# EAGLE design Minimal_carrier_board_for_CM4_rev_C (EAGLE 9.6.2)
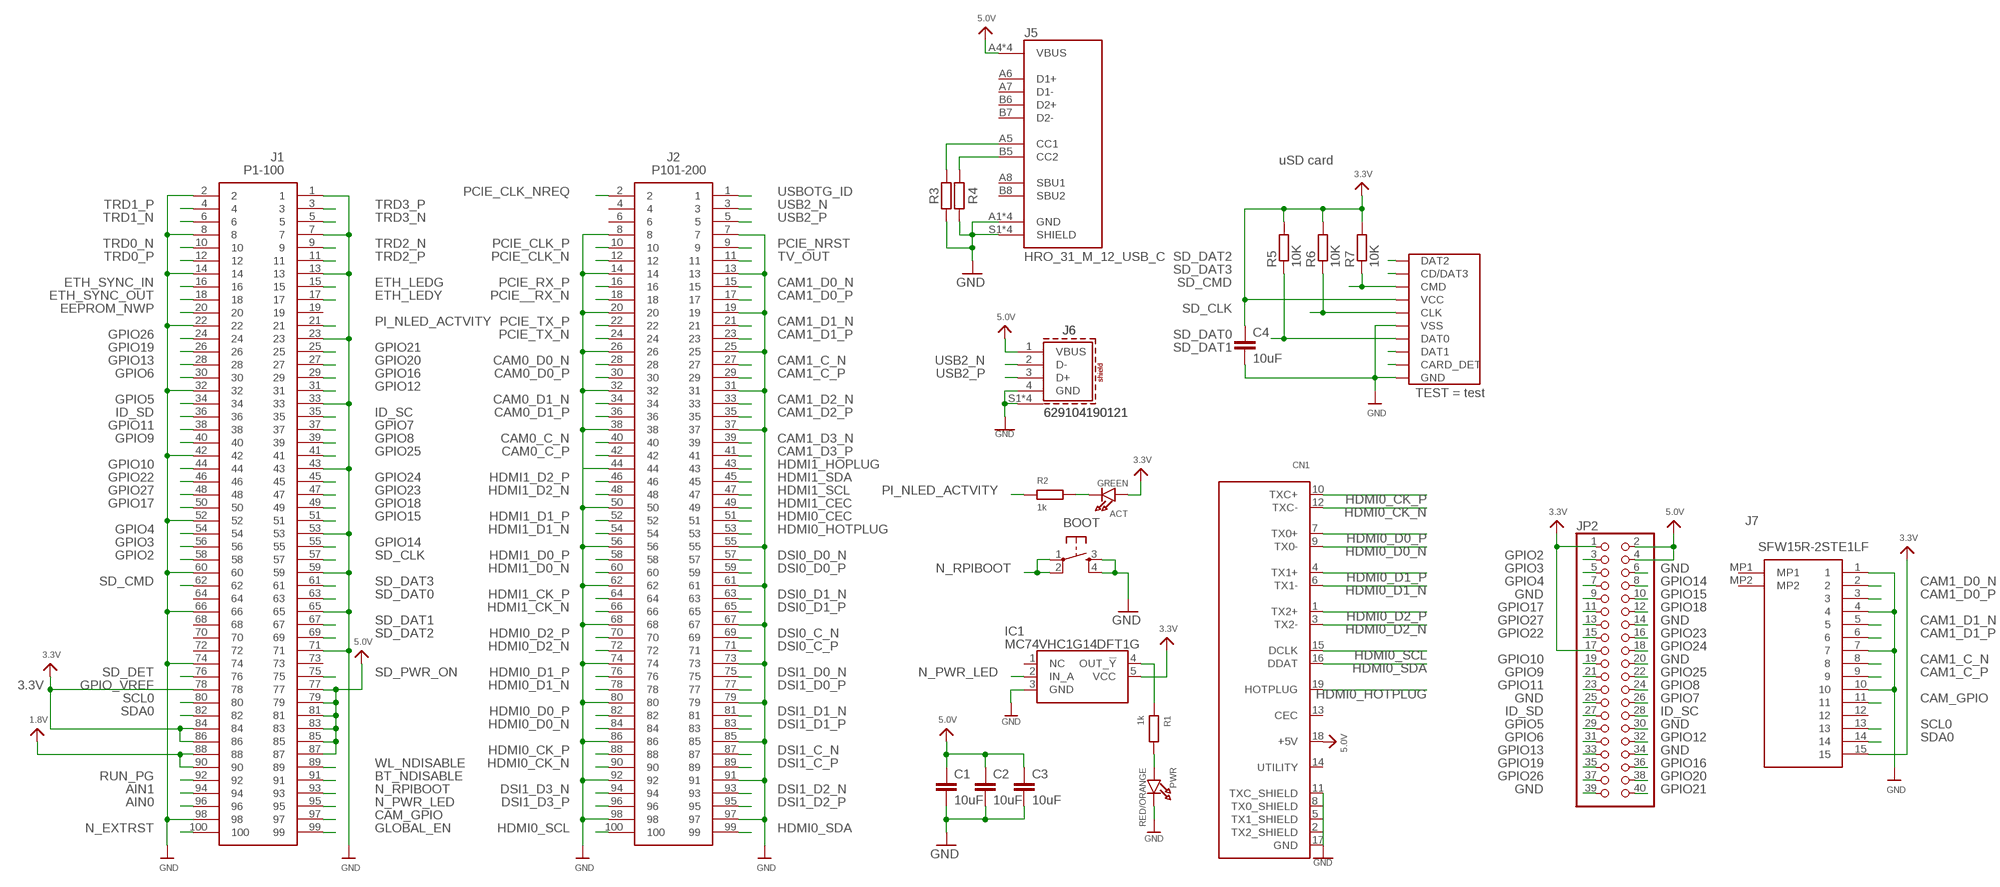
[diagram p0: schematic, sheet 1]

## Parts
ACT  GREEN  LED0805_NOOUTLINE  [CHIPLED_0805_NOOUTLINE]
BOOT  TACTILE_SWITCHE_5X5_MICRO_  [TACTILE_SWITCH_5X5_MICRO]
C1  10uF  C-EUC0805  [C0805]
C2  10uF  C-EUC0805  [C0805]
C3  10uF  C-EUC0805  [C0805]
C4  10uF  C-EUC0805  [C0805]
CN1  HDMI_MOLEX_47151-0001  [HDMI_MOLEX_47151-0001]
IC1  MC74VHC1G14DFT1G  [SOT65P210X110-5N]
J1  P1-100  DF40C-100DS-0.4V_51_  [DF40C100DS04V51]
J2  P101-200  DF40C-100DS-0.4V_51_  [DF40C100DS04V51]
J5  HRO_31_M_12_USB_C  [HRO_31_M_12_USB_C]
J6  629104190121  [629104190121]
J7  SFW15R-2STE1LF  [SFW15R2STE1LF]
JP2  PINHD-2X20  [2X20]
PWR  RED/ORANGE  LED0805_NOOUTLINE  [CHIPLED_0805_NOOUTLINE]
R1  1k  R-EU_R0805  [R0805]
R2  1k  R-EU_R0805  [R0805]
R3  5.1k  R-EU_R0805  [R0805]
R4  5.1k  R-EU_R0805  [R0805]
R5  10K  R-EU_R0805  [R0805]
R6  10K  R-EU_R0805  [R0805]
R7  10K  R-EU_R0805  [R0805]
SD_CARD  MICRO_SD_CARD_  [TFP09-2--12B]

## Nets
1.8V: J1.88 J1.90
3.3V: ACT.A C4.1 IC1.5(VCC) J1.78 J1.84 J1.86 J7.15 JP2.1 JP2.17 R5.2 R6.2 R7.2 SD_CARD.VCC
5.0V: C1.1 C2.1 C3.1 CN1.18(+5V) J1.77 J1.79 J1.81 J1.83 J1.85 J1.87 J5.A4(VBUS) J5.A9(VBUS) J5.B4(VBUS) J5.B9(VBUS) J6.1(VBUS) JP2.2 JP2.4
AIN0: J1.96
AIN1: J1.94
BT_NDISABLE: J1.91
CAM0_C_N: J2.40
CAM0_C_P: J2.42
CAM0_D0_N: J2.28
CAM0_D0_P: J2.30
CAM0_D1_N: J2.34
CAM0_D1_P: J2.36
CAM1_C_N [diff_pairs]: J2.27 J7.8
CAM1_C_P [diff_pairs]: J2.29 J7.9
CAM1_D0_N [diff_pairs]: J2.15 J7.2
CAM1_D0_P [diff_pairs]: J2.17 J7.3
CAM1_D1_N [diff_pairs]: J2.21 J7.5
CAM1_D1_P [diff_pairs]: J2.23 J7.6
CAM1_D2_N [diff_pairs]: J2.33
CAM1_D2_P [diff_pairs]: J2.35
CAM1_D3_N [diff_pairs]: J2.39
CAM1_D3_P [diff_pairs]: J2.41
CAM_GPIO: J1.97 J7.11
DSI0_C_N: J2.69
DSI0_C_P: J2.71
DSI0_D0_N: J2.57
DSI0_D0_P: J2.59
DSI0_D1_N: J2.63
DSI0_D1_P: J2.65
DSI1_C_N [diff_pairs]: J2.87
DSI1_C_P [diff_pairs]: J2.89
DSI1_D0_N [diff_pairs]: J2.75
DSI1_D0_P [diff_pairs]: J2.77
DSI1_D1_N [diff_pairs]: J2.81
DSI1_D1_P [diff_pairs]: J2.83
DSI1_D2_N [diff_pairs]: J2.93
DSI1_D2_P [diff_pairs]: J2.95
DSI1_D3_N [diff_pairs]: J2.94
DSI1_D3_P [diff_pairs]: J2.96
EEPROM_NWP: J1.20
ETH_LEDG: J1.15
ETH_LEDY: J1.17
ETH_SYNC_IN: J1.16
ETH_SYNC_OUT: J1.18
GLOBAL_EN: J1.99
GND: BOOT.3 BOOT.4 C1.2 C2.2 C3.2 C4.2 CN1.2(TX2_SHIELD) CN1.5(TX1_SHIELD) CN1.8(TX0_SHIELD) CN1.11(TXC_SHIELD) CN1.17(GND) IC1.3(GND) J1.1 J1.2 J1.7 J1.8 J1.13 J1.14 J1.22 J1.23 J1.32 J1.33 J1.42 J1.43 J1.52 J1.53 J1.59 J1.60 J1.65 J1.66 J1.71 J1.74 J1.98 J2.7 J2.8 J2.13 J2.14 J2.19 J2.20 J2.25 J2.26 J2.31 J2.32 J2.37 J2.38 J2.44 J2.50 J2.55 J2.56 J2.61 J2.62 J2.67 J2.68 J2.73 J2.74 J2.79 J2.80 J2.85 J2.86 J2.91 J2.92 J2.97 J2.98 J5.A1(GND) J5.A12(GND) J5.B1(GND) J5.B12(GND) J5.S1(SHIELD) J5.S2(SHIELD) J5.S3(SHIELD) J5.S4(SHIELD) J6.4(GND) J6.S1(SHIELD) J6.S2(SHIELD) J6.S3(SHIELD) J6.S4(SHIELD) J7.1 J7.4 J7.7 J7.10 JP2.6 JP2.9 JP2.14 JP2.20 JP2.25 JP2.30 JP2.34 JP2.39 PWR.C R3.1 R4.2 SD_CARD.GND SD_CARD.GND@1(GND) SD_CARD.GND@2(GND) SD_CARD.GND@3(VSS) SD_CARD.VSS(GND)
GPIO2: J1.58 JP2.3
GPIO3: J1.56 JP2.5
GPIO4: J1.54 JP2.7
GPIO5: J1.34 JP2.29
GPIO6: J1.30 JP2.31
GPIO7: J1.37 JP2.26
GPIO8: J1.39 JP2.24
GPIO9: J1.40 JP2.21
GPIO10: J1.44 JP2.19
GPIO11: J1.38 JP2.23
GPIO12: J1.31 JP2.32
GPIO13: J1.28 JP2.33
GPIO14: J1.55 JP2.8
GPIO15: J1.51 JP2.10
GPIO16: J1.29 JP2.36
GPIO17: J1.50 JP2.11
GPIO18: J1.49 JP2.12
GPIO19: J1.26 JP2.35
GPIO20: J1.27 JP2.38
GPIO21: J1.25 JP2.40
GPIO22: J1.46 JP2.15
GPIO23: J1.47 JP2.16
GPIO24: J1.45 JP2.18
GPIO25: J1.41 JP2.22
GPIO26: J1.24 JP2.37
GPIO27: J1.48 JP2.13
HDMI0_CEC: J2.51
HDMI0_CK_N [diff_pairs]: CN1.12(TXC-) J2.90
HDMI0_CK_P [diff_pairs]: CN1.10(TXC+) J2.88
HDMI0_D0_N [diff_pairs]: CN1.9(TX0-) J2.84
HDMI0_D0_P [diff_pairs]: CN1.7(TX0+) J2.82
HDMI0_D1_N [diff_pairs]: CN1.6(TX1-) J2.78
HDMI0_D1_P [diff_pairs]: CN1.4(TX1+) J2.76
HDMI0_D2_N [diff_pairs]: CN1.3(TX2-) J2.72
HDMI0_D2_P [diff_pairs]: CN1.1(TX2+) J2.70
HDMI0_HOTPLUG: CN1.19(HOTPLUG) J2.53
HDMI0_SCL: CN1.15(DCLK) J2.100
HDMI0_SDA: CN1.16(DDAT) J2.99
HDMI1_CEC: J2.49
HDMI1_CK_N: J2.66
HDMI1_CK_P: J2.64
HDMI1_D0_N: J2.60
HDMI1_D0_P: J2.58
HDMI1_D1_N: J2.54
HDMI1_D1_P: J2.52
HDMI1_D2_N: J2.48
HDMI1_D2_P: J2.46
HDMI1_HOPLUG: J2.43
HDMI1_SCL: J2.47
HDMI1_SDA: J2.45
ID_SC: J1.35 JP2.28
ID_SD: J1.36 JP2.27
N$1: ACT.C R2.2
N$3: J5.B5(CC2) R4.1
N$4: IC1.4(OUT_!Y) R1.1
N$5: J5.A5(CC1) R3.2
N$6: PWR.A R1.2
N$9: SD_CARD.CD(CARD_DET)
N_EXTRST: J1.100
N_PWR_LED: IC1.2(IN_A) J1.95
N_RPIBOOT: BOOT.1 BOOT.2 J1.93
PCIE__RX_N: J2.18
PCIE_CLK_N: J2.12
PCIE_CLK_NREQ: J2.2
PCIE_CLK_P: J2.10
PCIE_NRST: J2.9
PCIE_RX_P: J2.16
PCIE_TX_N: J2.24
PCIE_TX_P: J2.22
PI_NLED_ACTVITY: J1.21 R2.1
RUN_PG: J1.92
SCL0: J1.80 J7.13
SD_CLK: J1.57 R6.1 SD_CARD.CLK
SD_CMD: J1.62 R7.1 SD_CARD.CMD
SD_DAT0: J1.63 R5.1 SD_CARD.DAT0
SD_DAT1: J1.67 SD_CARD.DAT1
SD_DAT2: J1.69 SD_CARD.DAT2
SD_DAT3: J1.61 SD_CARD.CD/DAT3
SD_DET: J1.76
SD_PWR_ON: J1.75
SDA0: J1.82 J7.14
TRD0_N: J1.10
TRD0_P: J1.12
TRD1_N: J1.6
TRD1_P: J1.4
TRD2_N: J1.9
TRD2_P: J1.11
TRD3_N: J1.5
TRD3_P: J1.3
TV_OUT: J2.11
USB2_N: J2.3 J6.2(D-)
USB2_P [diff_pairs]: J2.5 J6.3(D+)
USBOTG_ID: J2.1
WL_NDISABLE: J1.89
Unconnected: CN1.13(CEC) CN1.14(UTILITY) IC1.1(NC) J1.19 J1.64 J1.68 J1.70 J1.72 J1.73 J2.4 J2.6 J5.A6(D1+) J5.A7(D1-) J5.A8(SBU1) J5.B6(D2+) J5.B7(D2-) J5.B8(SBU2) J7.12 J7.MP1 J7.MP2

## Notes on the sheet
- uSD card
- GPIO_VREF

## Power pins joined to a net without a drawn wire
GND: CN1.P$1(GND) CN1.P$2(GND) CN1.P$3(GND) CN1.P$4(GND)

## Library data of the parts
ACT PWR = dronecz:LED: LED 0603 - 0603 Surface Mount Package 2mA: Green LED - Low Power (3.9mcd, 2ma, 1.7Vf) - Digikey: 475-2709-2-ND Orange LED - Low Power (9.8mcd, 2ma, 1.8Vf) - Digikey: 475-1194-2-ND Red LED - Low Power (5mcd, 2ma, 1.8Vf) - Digikey: 475-1195-2-ND Yellow LED - Low Power (7mcd, 2ma, 1.8Vf) - Digikey: 475-1196-2-ND 5mA: Blue LED - Low Power (17mcd, 5ma, 2.9Vf) - Digikey: LNJ937W8CRACT-ND 0805 - 0805 Surface Mount Package 2mA: Red LED (8.8mcd, 2mA, 1.8Vf, Clear) - Low Power [Digikey: 475-2510-1-ND] Green LED (5mcd, 2mA, 1.8Vf, Clear) - Low Power [Digikey: 475-2730-1-ND] Yellow LED (11.3mcd, 2mA, 1.8Vf, Clear) - Low Power [Digikey: 475-2555-1-ND] 20mA: Red LED (104mcd, 20mA, Diffused) - LS R976 [Digikey: 475-1278-6-ND] Red LED (12mcd, 20mA, 2.0Vf, Clear) - APT2012EC [Digikey: 754-1128-1-ND] Green LED (15mcd, 20mA, 2.2Vf, Clear) - APT2012GC [Digikey: 754-1131-1-ND] Orange LED (160mcd, 20mA, 2.1Vf, Clear) - APT2012SECK [Digikey: 754-1130-1-ND] 1206 - 1206 Surface Mount Package Green LED (26mcd, 20mA, Diffused) - LG N971 [Digikey: 475-1407-6-ND] Red LED (15mcd, 20mA, Diffused) - LH N974 [Digikey: 475-1416-6-ND]
BOOT = dronecz:TACTILE_SWITCHE_5X5_MICRO
C1-C4 = rcl:C-EU: CAPACITOR, European symbol; SPICEPREFIX: C
CN1 = dronecz:HDMI_MOLEX_47151-0001; LINK: https://cz.mouser.com/ProductDetail/Molex/47151-1081?qs=rg3U%2F5nEhHf8zd%2FI8aNW2A%3D%3D
IC1 = dronecz:MC74VHC1G14DFT1G: Source: Datasheet <http://www.onsemi.com/pub/Collateral/MC74VHC1G14-D.PDF>; HEIGHT: 1.1mm; MANUFACTURER_NAME: ON Semiconductor; MANUFACTURER_PART_NUMBER: MC74VHC1G14DFT1G; MOUSER_PART_NUMBER: 863-MC74VHC1G14DFT1G; MOUSER_PRICE-STOCK: https://www.mouser.co.uk/ProductDetail/ON-Semiconductor/MC74VHC1G14DFT1G?qs=YOLdObVcOZkl2BbCxsVnXA%3D%3D
J1 J2 = dronecz:DF40C-100DS-0.4V_51_: HIROSE(HRS) - DF40C-100DS-0.4V(51) - CONNECTOR, STACKING, RCPT, 100POS, 2ROW Source: Datasheet <https://www.hirose.com/product/en/download_file/key_name/DF40C-100DS-0.4V(51)/category/Drawing (2D)/doc_file_id/46856/?file_category_id=6&item_id=06844033451&is_series=>; DESCRIPTION: HIROSE(HRS) - DF40C-100DS-0.4V(51) - CONNECTOR, STACKING, RCPT, 100POS, 2ROW; HEIGHT: 1.65mm; MANUFACTURER_NAME: Hirose; MANUFACTURER_PART_NUMBER: DF40C-100DS-0.4V(51); MOUSER_PART_NUMBER: 798-DF40C100DS0.4V51; MOUSER_PRICE-STOCK: https://www.mouser.co.uk/ProductDetail/Hirose-Connector/DF40C-100DS-04V51?qs=eDUdFcBPps2MEwbnuPvZzQ%3D%3D
J5 = dronecz:HRO_31_M_12_USB_C: USB Shielded I/O Receptacle; Type C; Right Angle; Surface Mount; Gold over Nickel
J6 = dronecz:629104190121: WR-COM USB 2.0 Type A Horizontal SMT Short Type Kind Properties Durability:1500 Mating cycles Quality Class:1500 Mating cycles Connector Type:USB 2.0 Gender:Receptacle Type:Horizontal - Short Type General Information Operating Temperature:-40 up to +85 °C Compliance:RoHS Electrical Properties IR 1:1.5A Working Voltage:30V (AC) Withstanding Voltage:500 V (AC) Contact Resistance:30 mΩ Material Properties Insulator Material:LCP Insulator Flammability Rating:UL94 V-0 Color:Black Cover Material:Brass Cover Plating:Nickel Contact Material:Brass Contact Plating:Gold over Nickel Contact Type:Stamped Shielding Material:Brass Shielding Plating:Nickel <https://www.we-online.com/catalog/media/o85075v209%20Family_WR-COM_629104190121.jpg> Details see: https://www.we-online.com/catalog/en/COM_2_0_SMT_TYPE_A_HORIZONTAL_SHORT_TYPE/ Updated by Ella Wu 2020-08-05 2020 (C) Würth Elektronik; APPLICATION: USB 2.0; DATASHEET-URL: https://www.we-online.com/catalog/datasheet/629104190121.pdf; GERDER: Receptacle; INTERFACE-TYPE: Type A; IR1: 1.5A; MOUNT: SMT; PACKAGING: Tape and Reel & Mylar; PART-NUMBER: 629104190121; PINS: 4; TYPE: Horizontal - Short Type; WORKING-VOLTAGE: 30V(AC)
J7 = dronecz:SFW15R-2STE1LF: FFC & FPC Connectors 15P SIDE SMT ZIF UPPER CONTACT Source: Datasheet <https://cdn.amphenol-icc.com/media/wysiwyg/files/drawing/sfw12lf.pdf>; DESCRIPTION: FFC & FPC Connectors 15P SIDE SMT ZIF UPPER CONTACT; HEIGHT: 2.7mm; MANUFACTURER_NAME: Amphenol; MANUFACTURER_PART_NUMBER: SFW15R-2STE1LF; MOUSER_PART_NUMBER: 649-SFW15R-2STE1LF; MOUSER_PRICE-STOCK: https://www.mouser.co.uk/ProductDetail/Amphenol-FCI/SFW15R-2STE1LF/?qs=XRaITl65jnu3B148xsdn9A%3D%3D
JP2 = pinhead:PINHD-2X20: PIN HEADER
R1-R7 = rcl:R-EU_: RESISTOR, European symbol; SPICEPREFIX: R
SD_CARD = dronecz:MICRO_SD_CARD; TEST: test

## Net classes
1 diff_pairs: width 0.152 mm

## Board
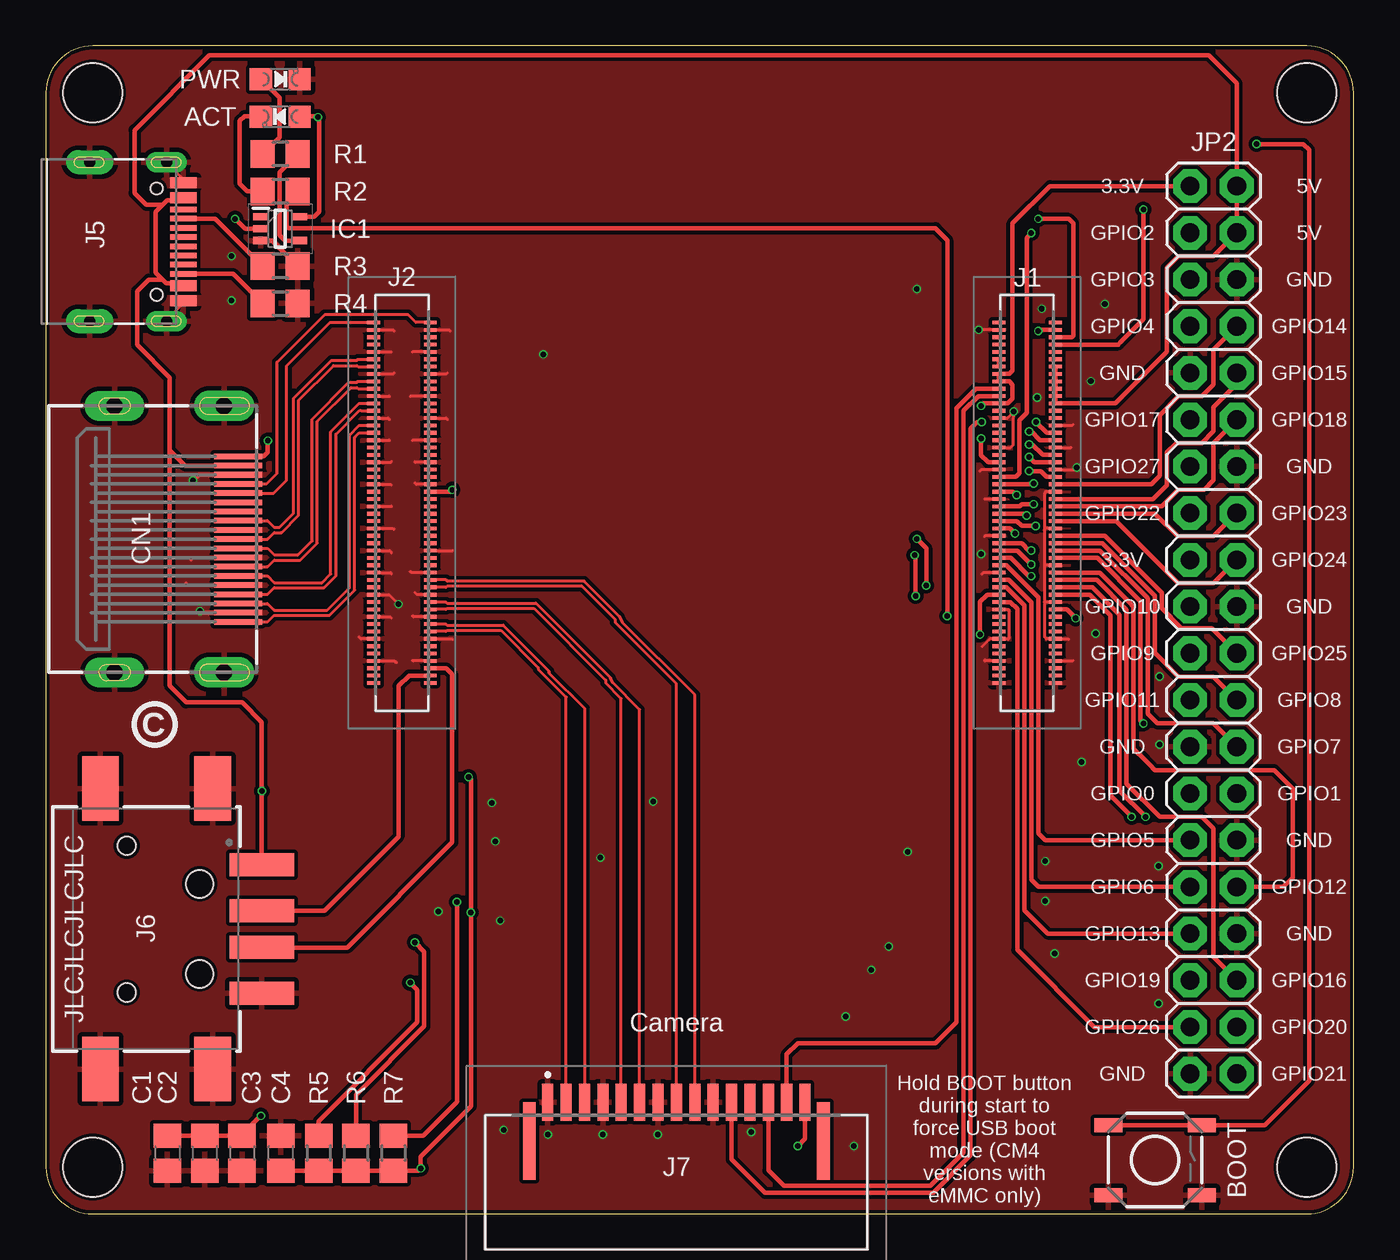
[diagram p1: board, top side]
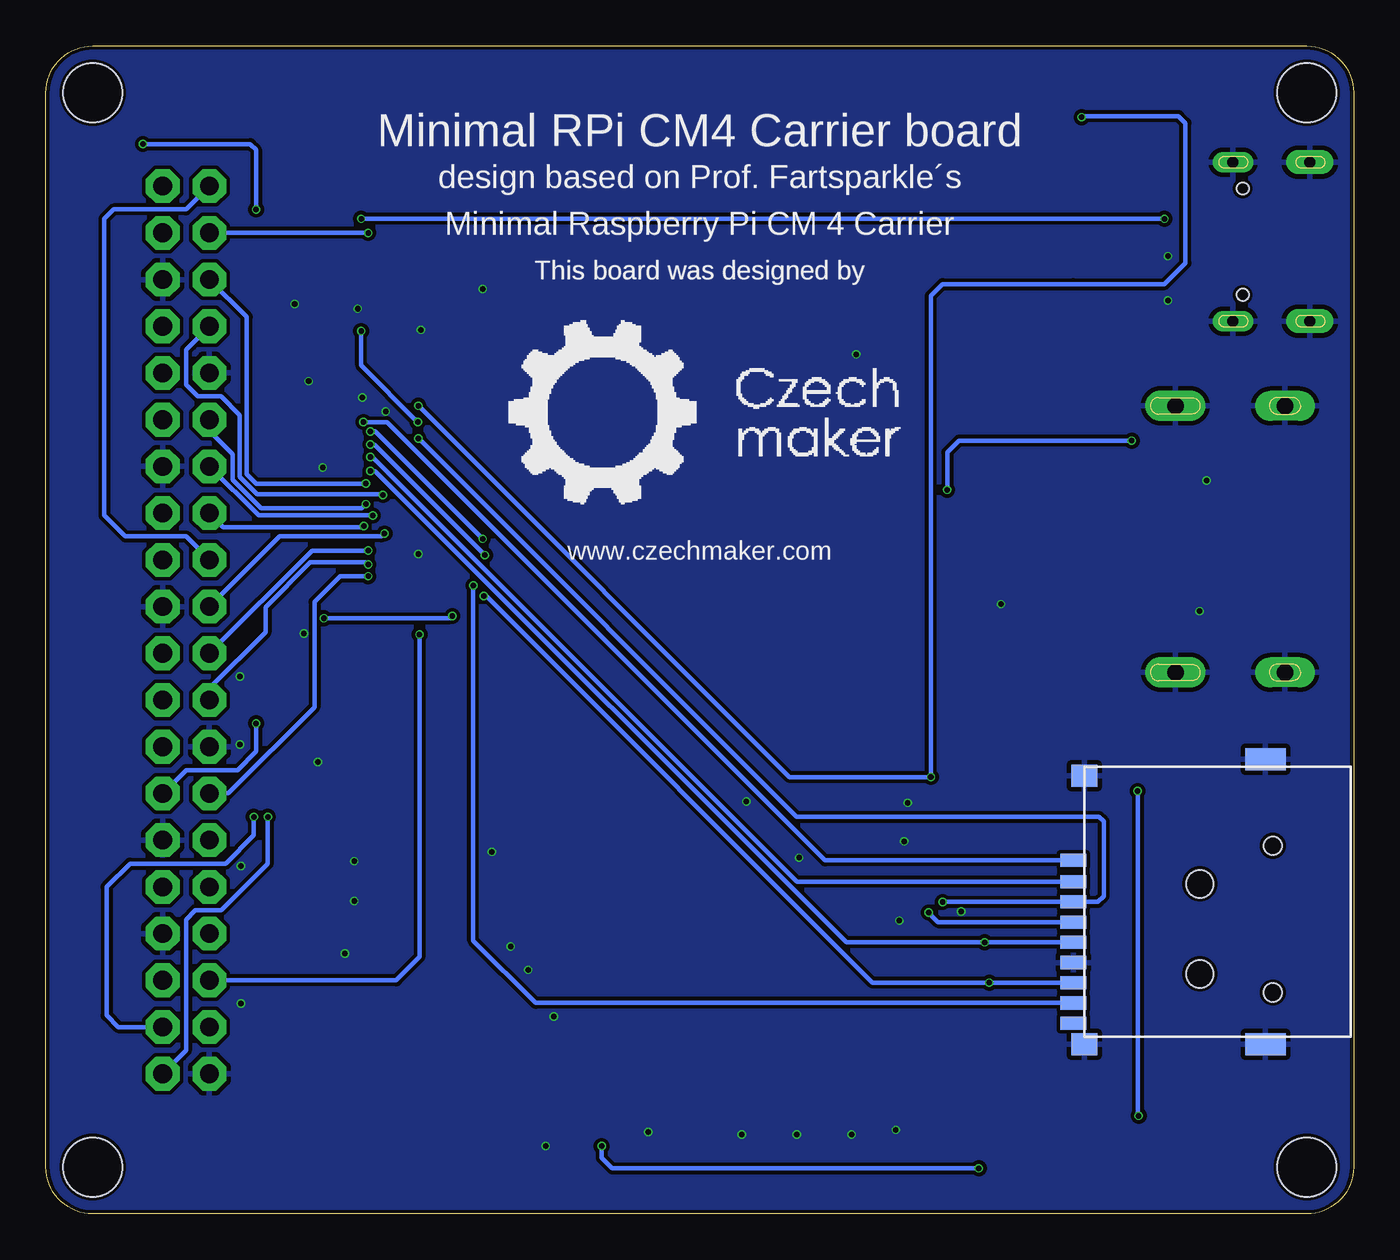
[diagram p2: board, bottom side, seen from below]

Size 71.12 x 63.5 mm. Coordinates in mm from the lower left corner, seen from the top.
Outline: 2.54,0 68.58,0 arc90 71.12,2.54 71.12,60.96 arc90 68.58,63.5 2.54,63.5 arc90 0,60.96 0,2.54 arc90 2.54,0
Copper layers (1*16): Top 0.035mm / dielectric 1.6mm / Bottom 0.035mm
Design rules "jlcpcb2layer": minimum track width 5mil, minimum drill 0.3mm, track to track 5mil, track to pad 5mil, pad to pad 5mil, via to via 5mil, smd to smd 5mil, copper to edge 0.2mm, drill to drill 6mil, minimum pad ring 10mil, minimum via ring 3mil, stop-mask expansion 4mil, vias tented up to drill 0mil, thermal gap 10mil
Holes 3.2 mm at 68.58,2.54 2.54,2.54 68.58,60.96 2.54,60.96

### Footprints (pad centres in the part's own frame; a part is rotated, then mirrored left to right if it is on the bottom)
CHIPLED_0805_NOOUTLINE = smd 1.2 x 1.2: A 0,-1.05; C 0,1.05
TACTILE_SWITCH_5X5_MICRO = smd 1.524 x 0.762: 1 -2.54,1.905; 2 2.54,1.905; 3 -2.54,-1.905; 4 2.54,-1.905
C0805 = smd 1.3 x 1.5: 1 -0.95,0; 2 0.95,0
HDMI_MOLEX_47151-0001 = smd 0.3 x 2.6: 1 4.5,0; 2 4,0; 3 3.5,0; 4 3,0; 5 2.5,0; 6 2,0; 7 1.5,0; 8 1,0; 9 0.5,0; 10 0,0; 11 -0.5,0; 12 -1,0; 13 -1.5,0; 14 -2,0; 15 -2.5,0; 16 -3,0; 17 -3.5,0; 18 -4,0; 19 -4.5,0 | drill 0.9 pad 1.65 long: P$1 -7.25,-0.76; P$2 7.25,-0.76 | drill 0.9 pad 1.5 long: P$3 7.25,-6.72; P$4 -7.25,-6.72
SOT65P210X110-5N = smd 0.85 x 0.4: 1 -1.05,0.65; 2 -1.05,0; 3 -1.05,-0.65; 4 1.05,-0.65; 5 1.05,0.65
DF40C100DS04V51 = smd 0.2 x 0.7: 1 -9.8,-1.54; 2 -9.8,1.54; 3 -9.4,-1.54; 4 -9.4,1.54; 5 -9,-1.54; 6 -9,1.54; 7 -8.6,-1.54; 8 -8.6,1.54; 9 -8.2,-1.54; 10 -8.2,1.54; 11 -7.8,-1.54; 12 -7.8,1.54; 13 -7.4,-1.54; 14 -7.4,1.54; 15 -7,-1.54; 16 -7,1.54; 17 -6.6,-1.54; 18 -6.6,1.54; 19 -6.2,-1.54; 20 -6.2,1.54; 21 -5.8,-1.54; 22 -5.8,1.54; 23 -5.4,-1.54; 24 -5.4,1.54; 25 -5,-1.54; 26 -5,1.54; 27 -4.6,-1.54; 28 -4.6,1.54; 29 -4.2,-1.54; 30 -4.2,1.54; 31 -3.8,-1.54; 32 -3.8,1.54; 33 -3.4,-1.54; 34 -3.4,1.54; 35 -3,-1.54; 36 -3,1.54; 37 -2.6,-1.54; 38 -2.6,1.54; 39 -2.2,-1.54; 40 -2.2,1.54; 41 -1.8,-1.54; 42 -1.8,1.54; 43 -1.4,-1.54; 44 -1.4,1.54; 45 -1,-1.54; 46 -1,1.54; 47 -0.6,-1.54; 48 -0.6,1.54; 49 -0.2,-1.54; 50 -0.2,1.54; 51 0.2,-1.54; 52 0.2,1.54; 53 0.6,-1.54; 54 0.6,1.54; 55 1,-1.54; 56 1,1.54; 57 1.4,-1.54; 58 1.4,1.54; 59 1.8,-1.54; 60 1.8,1.54; 61 2.2,-1.54; 62 2.2,1.54; 63 2.6,-1.54; 64 2.6,1.54; 65 3,-1.54; 66 3,1.54; 67 3.4,-1.54; 68 3.4,1.54; 69 3.8,-1.54; 70 3.8,1.54; 71 4.2,-1.54; 72 4.2,1.54; 73 4.6,-1.54; 74 4.6,1.54; 75 5,-1.54; 76 5,1.54; 77 5.4,-1.54; 78 5.4,1.54; 79 5.8,-1.54; 80 5.8,1.54; 81 6.2,-1.54; 82 6.2,1.54; 83 6.6,-1.54; 84 6.6,1.54; 85 7,-1.54; 86 7,1.54; 87 7.4,-1.54; 88 7.4,1.54; 89 7.8,-1.54; 90 7.8,1.54; 91 8.2,-1.54; 92 8.2,1.54; 93 8.6,-1.54; 94 8.6,1.54; 95 9,-1.54; 96 9,1.54; 97 9.4,-1.54; 98 9.4,1.54; 99 9.8,-1.54; 100 9.8,1.54
HRO_31_M_12_USB_C = smd 0.3 x 1.45: A1 -3.35,4.045; A4 -2.55,4.045; A5 -1.25,4.045; A6 -0.25,4.045; A7 0.25,4.045; A8 1.25,4.045; A9 2.55,4.045; A12 3.35,4.045; B1 3.05,4.045; B4 2.25,4.045; B5 1.75,4.045; B6 0.75,4.045; B7 -0.75,4.045; B8 -1.75,4.045; B9 -2.25,4.045; B12 -3.05,4.045 | drill 0.6 pad 1.1 long: S1 -4.32,3.13; S2 4.32,3.13 | drill 0.6 pad 1.3 long: S3 -4.32,-1.05; S4 4.32,-1.05 | hole 0.65: -2.89,2.6; 2.89,2.6
629104190121 = smd 1.25 x 3.5: 1 -3.5,6.28; 2 -1,6.28; 3 1,6.28; 4 3.5,6.28 | smd 3.5 x 2: S1 -7.625,3.6; S2 7.625,3.6; S3 -7.625,-2.5; S4 7.625,-2.5 | hole 1.5: -2.45,2.9; 2.45,2.9
SFW15R2STE1LF = smd 0.6 x 2: 1 -7,4; 2 -6,4; 3 -5,4; 4 -4,4; 5 -3,4; 6 -2,4; 7 -1,4; 8 0,4; 9 1,4; 10 2,4; 11 3,4; 12 4,4; 13 5,4; 14 6,4; 15 7,4 | smd 0.7 x 4.2: MP1 -8,1.9; MP2 8,1.9
2X20 = drill 1.016 octagon: 1 -24.13,-1.27; 2 -24.13,1.27; 3 -21.59,-1.27; 4 -21.59,1.27; 5 -19.05,-1.27; 6 -19.05,1.27; 7 -16.51,-1.27; 8 -16.51,1.27; 9 -13.97,-1.27; 10 -13.97,1.27; 11 -11.43,-1.27; 12 -11.43,1.27; 13 -8.89,-1.27; 14 -8.89,1.27; 15 -6.35,-1.27; 16 -6.35,1.27; 17 -3.81,-1.27; 18 -3.81,1.27; 19 -1.27,-1.27; 20 -1.27,1.27; 21 1.27,-1.27; 22 1.27,1.27; 23 3.81,-1.27; 24 3.81,1.27; 25 6.35,-1.27; 26 6.35,1.27; 27 8.89,-1.27; 28 8.89,1.27; 29 11.43,-1.27; 30 11.43,1.27; 31 13.97,-1.27; 32 13.97,1.27; 33 16.51,-1.27; 34 16.51,1.27; 35 19.05,-1.27; 36 19.05,1.27; 37 21.59,-1.27; 38 21.59,1.27; 39 24.13,-1.27; 40 24.13,1.27
R0805 = smd 1.3 x 1.5: 1 -0.95,0; 2 0.95,0
TFP09-2--12B = smd 0.711 x 1.422: CD -6.6,7.85; CD/DAT3 1.1,7.85; CLK -2.2,7.85; CMD 0,7.85; DAT0 -4.4,7.85; DAT1 -5.5,7.85; DAT2 2.25,7.85; VCC -1.1,7.85; VSS -3.3,7.85 | smd 1.2 x 2.2: GND -7.75,-2.6; GND@1 7.75,-2.6 | smd 1.2 x 1.4: GND@2 -7.75,7.25; GND@3 6.85,7.25 | hole 1: -4.93,-3; 3.05,-3

### Placement (x,y rotation side)
ACT  12.74,59.66 90 top
BOOT  60.33,2.92 0 top
C1  6.6,3.3 270 top
C2  8.64,3.3 270 top
C3  10.67,3.3 270 top
C4  12.78,3.3 90 top
CN1  10.45,36.69 270 top
IC1  12.74,53.56 0 top
J1  53.36,38.67 90 top
J2  19.36,38.67 90 top
J5  3.43,52.86 270 top
J6  5.46,15.49 270 top
J7  34.29,2.06 0 top
JP2  63.5,31.75 270 top
PWR  12.74,61.69 270 top
R1  12.74,57.63 180 top
R2  12.74,55.6 180 top
R3  12.74,51.53 180 top
R4  12.74,49.5 0 top
R5  14.83,3.3 270 top
R6  16.87,3.3 270 top
R7  18.9,3.3 270 top
SD_CARD  7.39,16.97 90 bottom

### Tracks (layer width: path | path; a pad name or v marks a point on that pad's centre or on a via)
1.8V
  Top 0.254: J1.88 J1.90
3.3V  (via drill 0.3)
  Top 0.254: IC1.5 14.59,54.21 14.86,54.48 14.86,59.56 v14.8,59.63 14.73,59.69 13.82,59.69 ACT.A | JP2.1 54.61,55.88 52.58,53.85 52.58,45.85 52.4,45.67 J1.86 J1.84 52.4,45.27 52.58,45.09 52.58,44.32 52.32,44.07 J1.78 51,44.07 v50.87,43.94 | C4.1 R5.2 R6.2 R7.2 20.26,2.35 v20.38,2.48 20.38,3.11 23.11,5.84 v23.11,16.38 23.11,23.62 v22.99,23.75 | J7.15 41.29,4.08 v40.89,3.68
  Bottom 0.254: v14.8,59.63 14.73,59.69 9.53,59.69 9.14,59.31 9.14,51.69 10.29,50.55 15.24,50.55 22.35,50.55 22.99,49.91 v22.99,23.75 30.67,23.75 v50.86,43.94 v50.87,43.94 | JP2.1 63.5,54.61 67.44,54.61 67.94,54.1 67.94,37.97 66.8,36.83 63.5,36.83 JP2.17 | v23.11,16.38 22.6,15.87 SD_CARD.VCC | v40.89,3.68 40.89,3.05 40.32,2.48 v20.38,2.48
5.0V  (via drill 0.3)
  Top 0.152: J5.A4 J5.B9 | J5.B4 J5.A9
  Top 0.254: CN1.18 7.57,40.69 6.73,41.53 | 6.35,50.8 5.59,50.8 4.95,50.16 4.95,47.24 6.73,45.47 6.73,41.53 | J6.1 v11.74,22.99 11.74,26.74 10.67,27.81 7.62,27.81 6.73,28.7 6.73,41.53 | 6.35,54.86 5.46,54.86 4.83,55.5 4.83,58.93 8.89,62.99 63.25,62.99 64.77,61.47 JP2.2 JP2.4 63.5,52.07 61.59,52.07 60.96,51.44 60.96,46.86 58.16,44.07 J1.77 J1.79 J1.81 J1.83 J1.85 J1.87 | C3.1 C2.1 C1.1 10.6,4.25 v11.68,5.33 | J5.B4 6.54,50.61 6.35,50.8 | J5.B9 6.6,55.11 6.35,54.86 | 6.35,50.8 5.97,51.18 5.97,54.48 6.35,54.86
  Bottom 0.254: v11.74,22.99 11.74,5.39 v11.68,5.33
CAM1_C_N
  Top 0.152: J7.8 34.29,28.83 30.95,32.17 30.95,32.33 29.16,34.13 21.82,34.13 21.76,34.07 J2.27
CAM1_C_P
  Top 0.152: J7.9 35.29,28.22 31.34,32.18 31.2,32.47 29.27,34.41 21.81,34.41 21.75,34.47 J2.29
CAM1_D0_N
  Top 0.152: J7.2 28.29,28.1 26.77,29.61 26.77,29.7 24.75,31.73 21.82,31.73 21.76,31.67 J2.15
CAM1_D0_P
  Top 0.152: J7.3 29.29,27.49 27.38,29.41 27.38,29.49 24.86,32.01 21.81,32.01 21.75,32.07 J2.17
CAM1_D1_N
  Top 0.152: J7.5 31.29,28.02 30.44,28.87 30.44,29.02 26.54,32.93 21.82,32.93 21.76,32.87 J2.21
CAM1_D1_P
  Top 0.152: J7.6 32.29,27.41 30.8,28.9 30.72,29.14 26.66,33.21 21.81,33.21 21.75,33.27 J2.23
CAM_GPIO  (via drill 0.3)
  Top 0.254: J7.11 37.29,2.97 39.12,1.14 48.26,1.14 50.29,3.17 50.29,42.7 50.65,43.05 v50.9,43.05 | v53.98,48.01 54.03,48.07 J1.97
  Bottom 0.254: v50.9,43.05 53.98,46.13 v53.98,48.01
GND  (via drill 0.3)
  Top 0.152: CN1.2 10.11,32.69 | 10.14,34.19 CN1.5 7.72,34.19 7.62,34.29 | 10.03,35.69 CN1.8 8,35.69 7.87,35.56 | 10.06,37.19 CN1.11 8.53,37.19 8.51,37.21 | J5.S1 7.47,56.27 J5.A1 J5.B12 | J5.B1 J5.A12 6.56,48.59 J5.S2 | J1.8 51.09,30.07 51.05,30.1 | 50.93,30.86 51.33,31.27 J1.14 51.85,31.24 52.32,31.24 52.38,31.3 52.38,32.84 52.35,32.87 J1.22 | J1.32 50.99,34.87 50.93,34.8 | J1.42 51.09,36.87 51.05,36.83 | 55.63,31.24 55.6,31.27 J1.13 54.41,31.27 54.3,31.37 54.3,33.27 | J1.7 55.85,30.07 55.88,30.1 | J1.52 51.05,38.86 | J1.60 50.88,40.47 50.8,40.39 | J1.53 54.38,39.27 54.31,39.2 54.31,37.34 | 54.3,35.31 54.3,37.2 54.31,37.21 54.31,37.34 | 54.3,35.31 54.3,33.27 | J1.43 54.38,37.27 54.31,37.34 | J1.33 54.34,35.27 54.3,35.31 | J1.23 54.31,33.27 54.3,33.27 | J1.65 55.74,41.67 55.75,41.66 | J1.71 55.82,42.87 55.88,42.93 | J1.59 55.96,40.47 v56.07,40.58 | J1.74 52.28,43.27 v52.64,43.62 52.64,43.32 52.61,43.28 52.61,41.81 52.46,41.67 J1.66 | J1.98 v50.74,48.07 | J2.26 18.66,33.67 v19.18,33.15 | J2.20 18.71,32.47 18.8,32.38 | J2.14 17.12,31.27 17.02,31.37 | J2.8 18.96,30.07 19.05,29.97 | J2.32 18.73,34.87 18.8,34.8 | J2.38 18.67,36.07 18.8,35.94 | J2.44 18.87,37.27 18.92,37.21 | J2.50 18.78,38.47 18.8,38.48 | J2.56 18.75,39.67 18.8,39.62 | J2.62 18.77,40.87 18.8,40.89 | J2.61 20.09,40.87 20.07,40.89 | J2.67 19.97,42.07 19.94,42.04 | J2.73 21.76,43.27 21.84,43.18 | J2.79 20.89,44.45 19.81,44.45 | J2.74 18.58,43.27 18.67,43.18 | J2.80 18.65,44.47 18.67,44.45 | J2.86 18.87,45.67 18.92,45.72 | J2.92 18.79,46.87 18.8,46.86 | J2.98 18.86,48.07 18.92,48.01 | J2.85 21.79,45.67 21.84,45.72 | J2.91 19.94,46.86 | J2.97 21.91,48.07 21.97,48.01 | J2.55 20.15,39.67 20.07,39.75
  Top 0.152: J2.68 18.64,42.07 18.67,42.04 | J2.25 20.18,33.67 20.07,33.78 | J2.19 19.98,32.47 19.94,32.51 | J2.13 22.07,31.27 22.1,31.24 | J2.7 19.97,30.07 19.94,30.1 | J2.37 22.1,36.07 | J2.31 19.87,34.87 19.81,34.92
  Top 0.254: IC1.3 12.31,52.91 R3.1 | CN1.17 8.31,40.19 v8,39.88 | CN1.2 8.46,32.69 v8.38,32.77
  Bottom 0.152: JP2.25 62.99,25.4
  other vias: 54.36,19.18 54.36,17.02 27.05,46.74 60.58,25.53 44.89,13.27 43.5,10.73 45.85,14.54 54.86,14.16 60.52,11.43 21.34,16.45 33.02,22.42 24.26,22.35 24.45,20.26 60.52,18.92 27.3,4.32 24.89,4.57 30.29,4.32 33.27,4.32 10.1,49.66 47.37,50.29 46.86,19.68 10.1,52.07 50.86,35.88 57.09,31.56 56.83,45.28 57.59,49.47 54.17,49.21 53.91,44.39 60.58,29.21 56.32,24.57 24.7,15.94 30.16,19.37 38.35,4.45 43.94,3.68
  pour Top (isolate 0.203): -0.4,64.43 72.42,64.43 72.42,-1.82 -0.4,-1.82
  pour Bottom (isolate 0.203): -2.68,65.2 73.57,65.2 73.57,-2.71 -2.68,-2.71
GPIO2  (via drill 0.3)
  Top 0.254: J1.58 52.74,40.07 52.94,40.26 52.94,43.15 53.34,43.55 53.34,53.09 v53.59,53.34
  Bottom 0.254: v53.59,53.34 JP2.3
GPIO3  (via drill 0.3)
  Top 0.254: v53.72,39.71 53.68,39.67 J1.56
  Bottom 0.254: JP2.5 60.2,48.77 60.2,40.22 59.68,39.71 v53.72,39.71
GPIO4  (via drill 0.3)
  Top 0.254: J1.54 52.6,39.27 v52.79,39.08
  Bottom 0.254: JP2.7 63.5,46.99 63.5,45.09 62.87,44.45 61.59,44.45 60.58,43.43 60.58,40.07 59.63,39.12 52.82,39.12 v52.79,39.08
GPIO5
  Top 0.254: JP2.29 54.36,20.32 53.98,20.7 53.98,33.53 52.24,35.27 J1.34
GPIO6
  Top 0.254: JP2.31 53.98,17.78 53.59,18.16 53.59,33.24 52.37,34.47 J1.30
GPIO7
  Top 0.254: JP2.26 63.5,26.67 60.45,26.67 59.92,27.2 59.92,33.46 57.31,36.07 J1.37
GPIO8
  Top 0.254: JP2.24 63.5,29.21 61.59,29.21 60.3,30.5 60.3,33.62 57.45,36.47 J1.39
GPIO9  (via drill 0.3)
  Top 0.254: J1.40 53.07,36.47 53.47,36.07 v53.59,36.07
  Bottom 0.254: v53.59,36.07 56.64,36.07 JP2.21
GPIO10  (via drill 0.3)
  Top 0.254: J1.44 52.44,37.27 v52.7,37
  Bottom 0.254: v52.7,37 52.87,36.83 58.42,36.83 JP2.19
GPIO11  (via drill 0.3)
  Top 0.254: J1.38 52.83,36.07 v53.59,35.31
  Bottom 0.254: JP2.23 62.23,28.57 59.18,31.62 59.18,32.99 56.74,35.43 53.72,35.43 v53.59,35.31
GPIO12
  Top 0.254: JP2.32 67.31,17.78 67.82,18.29 67.82,23.11 66.8,24.13 60.33,24.13 60.01,24.45 59.82,24.64 59.16,25.3 59.16,33.02 58.91,33.26 57.31,34.87 J1.31
GPIO13
  Top 0.254: JP2.33 54.48,15.24 53.21,16.51 53.21,33.09 52.23,34.07 J1.28
GPIO14
  Top 0.254: JP2.8 63.5,46.99 63.5,45.09 62.87,44.45 61.59,44.45 60.58,43.43 60.58,40.13 60.11,39.67 J1.55
GPIO15
  Top 0.254: JP2.10 64.77,45.12 63.5,43.85 63.5,42.55 62.87,41.91 61.47,41.91 60.96,41.4 60.96,39.62 60.2,38.87 J1.51
GPIO16
  Top 0.254: JP2.36 63.5,13.97 63.5,20.95 62.87,21.59 60.58,21.59 58.78,23.39 58.78,32.86 57.17,34.47 J1.29
GPIO17  (via drill 0.3)
  Top 0.254: J1.50 52.97,38.47 53.09,38.59 v53.72,38.59
  Bottom 0.254: JP2.11 62.23,42.59 60.96,41.31 60.96,39.91 59.41,38.35 53.95,38.35 v53.72,38.59
GPIO18
  Top 0.254: JP2.12 63.5,41.91 63.5,39.88 62.99,39.37 61.59,39.37 60.69,38.47 J1.49
GPIO19  (via drill 0.3)
  Top 0.254: J1.26 51.19,33.67 50.8,33.27 v50.8,31.5
  Bottom 0.254: v50.8,31.5 50.8,13.97 52.07,12.7 JP2.35
GPIO20  (via drill 0.3)
  Top 0.254: v59.82,21.59 58.4,23.01 58.4,32.58 56.9,34.07 J1.27
  Bottom 0.254: v59.82,21.59 59.82,20.57 61.34,19.05 66.55,19.05 67.82,17.78 67.82,10.79 67.18,10.16 JP2.38
GPIO21  (via drill 0.3)
  Top 0.254: v59.05,21.59 57.89,22.76 57.89,32.55 56.77,33.67 J1.25
  Bottom 0.254: v59.05,21.59 59.05,19.05 61.59,16.51 62.99,16.51 63.5,16 63.5,8.89 JP2.40
GPIO22  (via drill 0.3)
  Top 0.254: J1.46 52.81,37.67 53.07,37.41 v53.83,37.41
  Bottom 0.254: v53.83,37.41 53.83,37.34 61.47,37.34 JP2.15
GPIO23
  Top 0.254: JP2.16 63.5,36.83 61.55,36.83 60.32,38.07 J1.47
GPIO24
  Top 0.254: JP2.18 63.5,34.29 61.59,34.29 58.22,37.67 J1.45
GPIO25
  Top 0.254: JP2.22 63.4,31.85 61.75,31.85 60.68,32.92 60.68,33.78 57.59,36.87 J1.41
GPIO26
  Top 0.254: JP2.37 57.02,10.16 52.83,14.35 52.83,32.89 52.46,33.27 J1.24
GPIO27  (via drill 0.3)
  Top 0.254: J1.48 53.25,38.07 v53.34,37.97
  Bottom 0.254: JP2.13 59.56,37.97 v53.34,37.97
HDMI0_CK_N
  Top 0.152: CN1.12 12.05,37.69 12.41,37.33 12.7,37.33 13.46,38.09 13.46,44.34 15.53,46.41 16.91,46.41 16.97,46.47 J2.90
HDMI0_CK_P
  Top 0.152: CN1.10 12.05,36.69 12.41,37.05 12.82,37.05 13.74,37.97 13.74,44.23 15.64,46.13 16.92,46.13 16.98,46.07 J2.88
HDMI0_D0_N
  Top 0.152: CN1.9 12.05,36.19 12.41,35.83 13.72,35.83 14.48,36.59 14.48,43.21 16.47,45.21 16.91,45.21 16.97,45.27 J2.84
HDMI0_D0_P
  Top 0.152: CN1.7 12.05,35.19 12.41,35.55 13.83,35.55 14.76,36.47 14.76,43.1 16.59,44.93 16.92,44.93 16.98,44.87 J2.82
HDMI0_D1_N
  Top 0.152: CN1.6 12.05,34.69 12.41,34.33 15.02,34.33 15.49,34.8 15.49,42.52 17.05,44.07 J2.78
HDMI0_D1_P
  Top 0.152: CN1.4 12.05,33.69 12.41,34.05 15.14,34.05 15.77,34.68 15.77,42.4 17.07,43.69 17.12,43.69 17.14,43.67 J2.76
HDMI0_D2_N
  Top 0.152: CN1.3 12.05,33.19 12.41,32.83 15.3,32.83 16.51,34.04 16.51,42.33 17.05,42.87 J2.72
HDMI0_D2_P
  Top 0.152: CN1.1 12.05,32.19 12.41,32.55 15.42,32.55 16.79,33.92 16.79,42.22 17.04,42.47 J2.70
HDMI0_HOTPLUG  (via drill 0.3)
  Top 0.254: CN1.19 11.85,41.19 12.06,41.4 v12.06,42.04 | v22.1,39.37 21.99,39.27 J2.53
  Bottom 0.254: v12.06,42.04 21.46,42.04 22.1,41.4 v22.1,39.37
HDMI0_SCL
  Top 0.152: CN1.15 12.39,39.19 13.08,39.88 13.08,46.1 15.45,48.47 J2.100
HDMI0_SDA
  Top 0.152: CN1.16 12,39.69 12.57,40.26 12.57,46.31 15.16,48.9 19.68,48.9 20.11,48.47 J2.99
ID_SC  (via drill 0.3)
  Top 0.254: v59.69,26.67 59.54,26.82 59.54,33.3 57.17,35.67 J1.35
  Bottom 0.254: v59.69,26.67 59.69,25.15 60.71,24.13 63.5,24.13 JP2.28
ID_SD  (via drill 0.3)
  Top 0.254: J1.36 52.47,35.67 53.47,34.67 v53.59,34.67
  Bottom 0.254: JP2.27 61.21,22.86 56.52,27.56 56.52,33.27 55.12,34.67 v53.59,34.67
N$1
  Top 0.254: R2.2 10.95,55.6 10.54,56.01 10.54,59.44 10.79,59.69 11.66,59.69 ACT.C
N$3
  Top 0.254: J5.B5 10.18,51.11 R4.1
N$4
  Top 0.254: IC1.4 13,52.91 12.7,53.21 12.7,56.64 R1.1
N$5
  Top 0.254: J5.A5 9.21,54.11 R3.2
N$6
  Top 0.254: R1.2 12.7,58.54 12.7,60.68 PWR.A
N_PWR_LED  (via drill 0.3)
  Top 0.254: IC1.2 10.82,53.56 v10.29,54.1 | J1.95 55.79,47.67 55.88,47.75 55.88,53.85 55.63,54.1 v53.98,54.1
  Bottom 0.254: v10.29,54.1 v53.98,54.1
N_RPIBOOT  (via drill 0.3)
  Top 0.254: v65.85,58.17 68.39,58.17 68.71,57.85 68.71,7.24 66.29,4.83 BOOT.2 BOOT.1 | v59.69,54.61 59.69,48.64 58.42,47.37 58.31,47.27 J1.93
  Bottom 0.254: v65.85,58.17 60.01,58.17 59.69,57.85 v59.69,54.61
PI_NLED_ACTVITY  (via drill 0.3)
  Top 0.254: R2.1 13.08,54.99 13.08,53.72 13.21,53.59 48.38,53.59 49.02,52.95 v49.02,32.51 | J1.21 55.53,32.87 v56.01,32.38
  Bottom 0.254: v56.01,32.38 49.15,32.38 v49.02,32.51
SCL0
  Top 0.254: J7.13 39.29,2.37 40.13,1.52 48.1,1.52 49.91,3.33 49.91,43.66 50.72,44.47 J1.80
SD_CLK  (via drill 0.3)
  Top 0.254: R6.1 16.87,6.49 20.57,10.2 20.57,14.26 v20.07,14.77 | v53.47,40.39 54.1,40.39 54.42,40.07 J1.57
  Bottom 0.254: SD_CARD.CLK v20.07,14.77 27.59,14.77 53.21,40.39 v53.47,40.39
SD_CMD  (via drill 0.3)
  Top 0.254: R7.1 20.51,4.25 22.35,6.1 v22.35,16.95 | J1.62 51.25,40.87 50.86,41.26 v50.86,42.16
  Bottom 0.254: v50.86,42.16 30.29,21.59 13.84,21.59 13.59,21.34 13.59,17.27 13.89,16.97 SD_CARD.CMD 22.34,16.97 v22.35,16.95
SD_DAT0  (via drill 0.3)
  Top 0.254: v19.81,12.57 20.19,12.19 20.19,10.41 14.83,5.05 R5.1 | v47.24,35.81 47.3,35.76 v47.3,33.6 | v53.47,41.83 53.66,41.83 54.23,41.27 J1.63
  Bottom 0.254: SD_CARD.DAT0 v19.81,12.57 26.16,12.57 47.24,33.66 v47.3,33.6 | v47.24,35.81 53.26,41.83 v53.47,41.83
SD_DAT1  (via drill 0.3)
  Top 0.254: v47.37,36.7 47.88,36.2 v47.88,34.16 | v53.47,42.55 53.59,42.55 54.07,42.07 J1.67
  Bottom 0.254: SD_CARD.DAT1 44.49,11.47 47.88,14.86 v47.88,34.16 | v47.37,36.7 53.21,42.55 v53.47,42.55
SD_DAT2  (via drill 0.3)
  Top 0.254: J1.69 54.44,42.47 v53.85,43.05
  Bottom 0.254: SD_CARD.DAT2 28.74,19.22 52.58,43.05 v53.85,43.05
SD_DAT3  (via drill 0.3)
  Top 0.254: J1.61 53.75,40.87 v53.47,41.15
  Bottom 0.254: SD_CARD.CD/DAT3 30.26,18.07 53.34,41.15 v53.47,41.15
SDA0
  Top 0.254: J1.82 50.58,44.87 49.53,43.81 49.53,10.41 48.39,9.27 40.89,9.27 40.29,8.67 J7.14
USB2_N
  Top 0.254: J6.2 15.16,16.49 19.18,20.51 19.18,28.7 19.74,29.27 J2.3
USB2_P
  Top 0.254: J6.3 11.76,14.48 16.38,14.48 22.1,20.19 22.1,29.34 21.77,29.67 J2.5

### Text on the board
tPlace: 3.3V | 5V | GPIO2 | 5V | GPIO3 | GND | GPIO4 | GPIO14 | GND | GPIO15 | GPIO17 | GPIO18 | GPIO27 | GND | GPIO22 | GPIO23 | 3.3V | GPIO24 | GPIO10 | GND | GPIO9 | GPIO25 | GPIO11 | GPIO8 | C | GND | GPIO7 | GPIO0 | GPIO1 | GPIO5 | GND | GPIO6 | GPIO12 | JLCJLCJLCJLC | GPIO13 | GND | GPIO19 | GPIO16 | Camera | GPIO26 | GPIO20 | GND | GPIO21 | Hold BOOT button / during start to / force USB boot / mode (CM4 / versions with / eMMC only) | BOOT
bPlace: Minimal RPi CM4 Carrier board | design based on Prof. Fartsparkle´s | Minimal Raspberry Pi CM 4 Carrier | This board was designed by | This board was designed by | www.czechmaker.com
_tNames: 3V3